# EAGLE design reamiga 1200 mouse USB v1 (EAGLE 7.5.0)
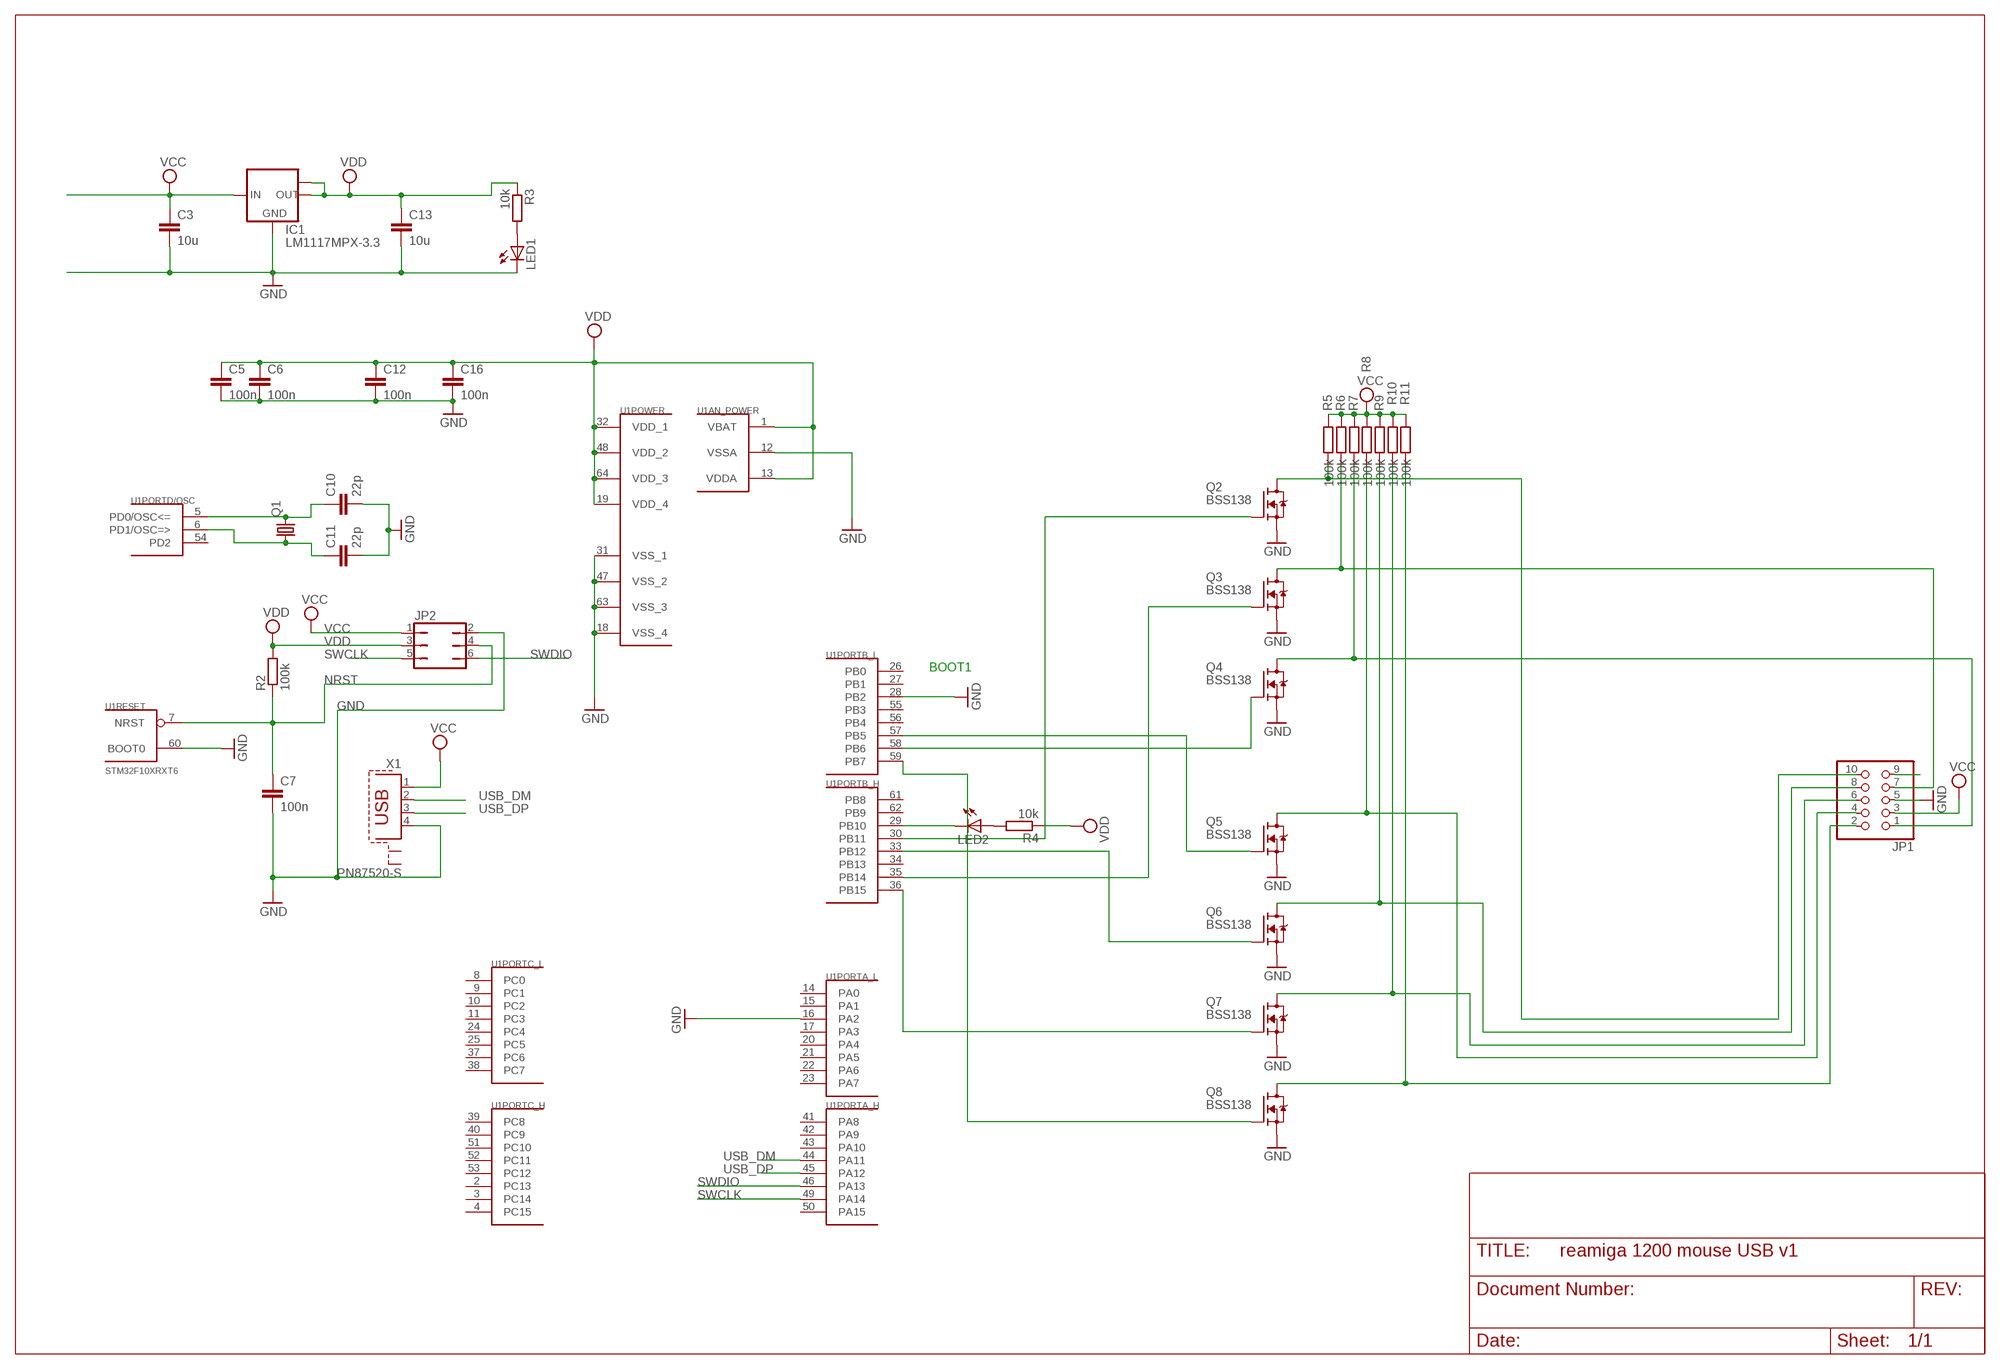
[diagram p0: schematic, sheet 1]

## Parts
C3  10u  C-EUC1206  [C1206]
C5  100n  C-EUC0603  [C0603]
C6  100n  C-EUC0603  [C0603]
C7  100n  C-EUC0603  [C0603]
C10  22p  C-EUC0603  [C0603]
C11  22p  C-EUC0603  [C0603]
C12  100n  C-EUC0603  [C0603]
C13  10u  C-EUC1206  [C1206]
C16  100n  C-EUC0603  [C0603]
IC1  LM1117MPX-3.3  [SOT223]
JP1  PINHD-2X5  [2X05]
JP2  JP3Q  [JP3Q]
LED1  LEDSML0805  [SML0805]
LED2  LEDSML0805  [SML0805]
Q1  CRYSTALHC49S  [HC49/S]
Q2  BSS138  [SOT23]
Q3  BSS138  [SOT23]
Q4  BSS138  [SOT23]
Q5  BSS138  [SOT23]
Q6  BSS138  [SOT23]
Q7  BSS138  [SOT23]
Q8  BSS138  [SOT23]
R2  100k  R-EU_R0603  [R0603]
R3  10k  R-EU_R0603  [R0603]
R4  10k  R-EU_R0603  [R0603]
R5  100k  R-EU_R0603  [R0603]
R6  100k  R-EU_R0603  [R0603]
R7  100k  R-EU_R0603  [R0603]
R8  100k  R-EU_R0603  [R0603]
R9  100k  R-EU_R0603  [R0603]
R10  100k  R-EU_R0603  [R0603]
R11  100k  R-EU_R0603  [R0603]
U1  STM32F10XRXT6  [TQFP64]
X1  PN87520-S  [PN87520-S]

## Nets
GND: C3.2 C5.2 C6.2 C7.2 C10.2 C11.2 C12.2 C13.2 C16.2 IC1.1(GND) JP1.5 JP2.2 LED1.C Q2.2(S) Q3.2(S) Q4.2(S) Q5.2(S) Q6.2(S) Q7.2(S) Q8.2(S) U1.12(AN_POWER:VSSA) U1.16(PORTA_L:PA2) U1.18(POWER:VSS_4) U1.28(PORTB_L:PB2) U1.31(POWER:VSS_1) U1.47(POWER:VSS_2) U1.60(RESET:BOOT0) U1.63(POWER:VSS_3) X1.4
N$1: C10.1 Q1.2 U1.5(PORTD/OSC:PD0/OSC<=)
N$2: C11.1 Q1.1 U1.6(PORTD/OSC:PD1/OSC=>)
N$3: Q3.1(G) U1.35(PORTB_H:PB14)
N$4: JP1.9
N$5: Q5.1(G) U1.57(PORTB_L:PB5)
N$6: Q4.1(G) U1.58(PORTB_L:PB6)
N$7: LED2.A R4.2
N$8: LED2.C U1.29(PORTB_H:PB10)
N$12: LED1.A R3.2
N$13: Q2.1(G) U1.30(PORTB_H:PB11)
N$17: Q6.1(G) U1.33(PORTB_H:PB12)
N$18: Q7.1(G) U1.36(PORTB_H:PB15)
N$19: Q8.1(G) U1.59(PORTB_L:PB7)
N$34: JP1.10 Q2.3(D) R5.2
N$35: JP1.7 Q3.3(D) R6.2
N$36: JP1.1 Q4.3(D) R7.2
N$37: JP1.4 Q5.3(D) R8.2
N$38: JP1.8 Q6.3(D) R9.2
N$39: JP1.6 Q7.3(D) R10.2
N$40: JP1.2 Q8.3(D) R11.2
NRST: C7.1 JP2.4 R2.1 U1.7(RESET:NRST)
SWCLK: JP2.5 U1.49(PORTA_H:PA14)
SWDIO: JP2.6 U1.46(PORTA_H:PA13)
USB_DM: U1.44(PORTA_H:PA11) X1.2
USB_DP: U1.45(PORTA_H:PA12) X1.3
VCC: C3.1 IC1.3(IN) JP1.3 JP2.1 R5.1 R6.1 R7.1 R8.1 R9.1 R10.1 R11.1 X1.1
VDD: C5.1 C6.1 C12.1 C13.1 C16.1 IC1.2(OUT) IC1.TAB(OUT1) JP2.3 R2.2 R3.1 R4.1 U1.1(AN_POWER:VBAT) U1.13(AN_POWER:VDDA) U1.19(POWER:VDD_4) U1.32(POWER:VDD_1) U1.48(POWER:VDD_2) U1.64(POWER:VDD_3)
Unconnected: U1.2(PORTC_H:PC13) U1.3(PORTC_H:PC14) U1.4(PORTC_H:PC15) U1.8(PORTC_L:PC0) U1.9(PORTC_L:PC1) U1.10(PORTC_L:PC2) U1.11(PORTC_L:PC3) U1.14(PORTA_L:PA0) U1.15(PORTA_L:PA1) U1.17(PORTA_L:PA3) U1.20(PORTA_L:PA4) U1.21(PORTA_L:PA5) U1.22(PORTA_L:PA6) U1.23(PORTA_L:PA7) U1.24(PORTC_L:PC4) U1.25(PORTC_L:PC5) U1.26(PORTB_L:PB0) U1.27(PORTB_L:PB1) U1.34(PORTB_H:PB13) U1.37(PORTC_L:PC6) U1.38(PORTC_L:PC7) U1.39(PORTC_H:PC8) U1.40(PORTC_H:PC9) U1.41(PORTA_H:PA8) U1.42(PORTA_H:PA9) U1.43(PORTA_H:PA10) U1.50(PORTA_H:PA15) U1.51(PORTC_H:PC10) U1.52(PORTC_H:PC11) U1.53(PORTC_H:PC12) U1.54(PORTD/OSC:PD2) U1.55(PORTB_L:PB3) U1.56(PORTB_L:PB4) U1.61(PORTB_H:PB8) U1.62(PORTB_H:PB9) X1.S1 X1.S2

## Notes on the sheet
- BOOT1

## Library data of the parts
C3 C5-C7 C10-C13 C16 = rcl:C-EU: CAPACITOR, European symbol; SPICEPREFIX: C
IC1 = lm1117:LM1117MPX-*
JP1 = pinhead:PINHD-2X5: PIN HEADER
JP2 = jumper:JP3Q: JUMPER
LED1 LED2 = led:LED: LED OSRAM: - CHIPLED LG R971, LG N971, LY N971, LG Q971, LY Q971, LO R971, LY R971 LH N974, LH R974 LS Q976, LO Q976, LY Q976 LO Q996 - Hyper CHIPLED LW Q18S LB Q993, LB Q99A, LB R99A - SideLED LS A670, LO A670, LY A670, LG A670, LP A670 LB A673, LV A673, LT A673, LW A673 LH A674 LY A675 LS A676, LA A676, LO A676, LY A676, LW A676 LS A679, LY A679, LG A679 - Hyper Micro SIDELED® LS Y876, LA Y876, LO Y876, LY Y876 LT Y87S - SmartLED LW L88C, LW L88S LB L89C, LB L89S, LG L890 LS L89K, LO L89K, LY L89K LS L896, LA L896, LO L896, LY L896 - TOPLED LS T670, LO T670, LY T670, LG T670, LP T670 LSG T670, LSP T670, LSY T670, LOP T670, LYG T670 LG T671, LOG T671, LSG T671 LB T673, LV T673, LT T673, LW T673 LH T674 LS T676, LA T676, LO T676, LY T676, LB T676, LH T676, LSB T676, LW T676 LB T67C, LV T67C, LT T67C, LS T67K, LO T67K, LY T67K, LW E67C LS E67B, LA E67B, LO E67B, LY E67B, LB E67C, LV E67C, LT E67C LW T67C LS T679, LY T679, LG T679 LS T770, LO T770, LY T770, LG T770, LP T770 LB T773, LV T773, LT T773, LW T773 LH T774 LS E675, LA E675, LY E675, LS T675 LS T776, LA T776, LO T776, LY T776, LB T776 LHGB T686 LT T68C, LB T68C - Hyper Mini TOPLED® LB M676 - Mini TOPLED Santana® LG M470 LS M47K, LO M47K, LY M47K Source: http://www.osram.convergy.de LUXEON: - LUMILED® LXK2-PW12-R00, LXK2-PW12-S00, LXK2-PW14-U00, LXK2-PW14-V00 LXK2-PM12-R00, LXK2-PM12-S00, LXK2-PM14-U00 LXK2-PE12-Q00, LXK2-PE12-R00, LXK2-PE12-S00, LXK2-PE14-T00, LXK2-PE14-U00 LXK2-PB12-K00, LXK2-PB12-L00, LXK2-PB12-M00, LXK2-PB14-N00, LXK2-PB14-P00, LXK2-PB14-Q00 LXK2-PR12-L00, LXK2-PR12-M00, LXK2-PR14-Q00, LXK2-PR14-R00 LXK2-PD12-Q00, LXK2-PD12-R00, LXK2-PD12-S00 LXK2-PH12-R00, LXK2-PH12-S00 LXK2-PL12-P00, LXK2-PL12-Q00, LXK2-PL12-R00 Source: www.luxeon.com KINGBRIGHT: KA-3528ASYC Source: www.kingbright.com
Q1 = crystal:CRYSTAL: CRYSTAL; OC_FARNELL: 1667008; OC_NEWARK: unknown
Q2-Q8 = bss138_10:BSS138: BSS138 N-Channel Logic Level Enhancement Mode Field Effect Transistor Source: http://www.fairchildsemi.com/datasheets/BS/BSS138.pdf; MF: Fairchild; MPN: BSS138; OC_FARNELL: 9845330; OC_NEWARK: 67R2009
R2-R11 = rcl:R-EU_: RESISTOR, European symbol; SPICEPREFIX: R
U1 = stm32:STM32F10XRXT6: STM32F101/103 64pin LQFP
X1 = con-berg:PN87520-S; OC_FARNELL: unknown; OC_NEWARK: unknown

## Board
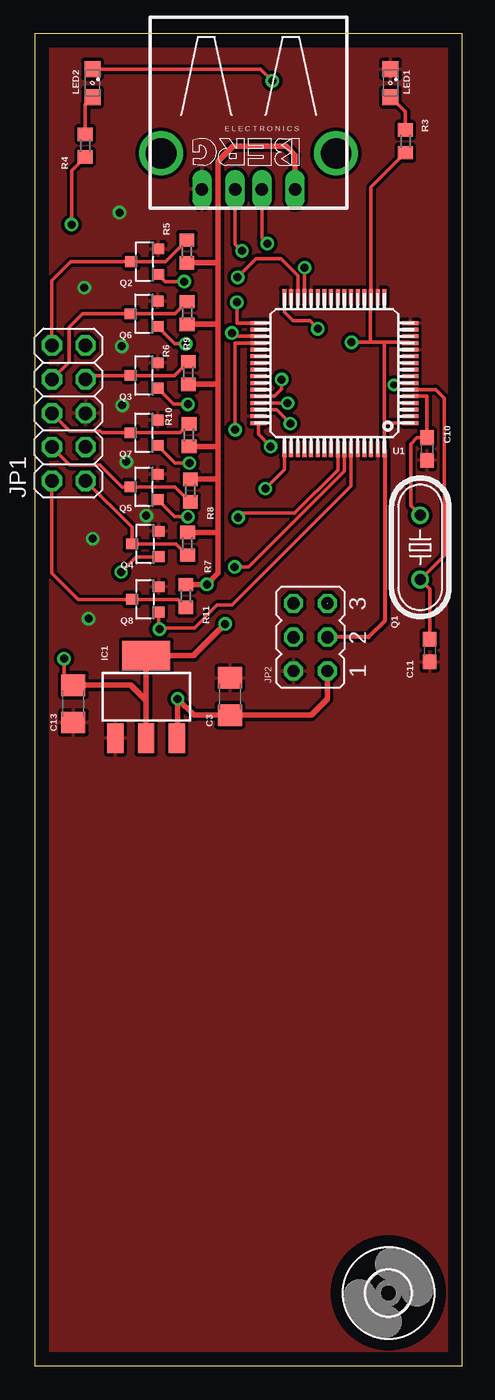
[diagram p1: board, top side]
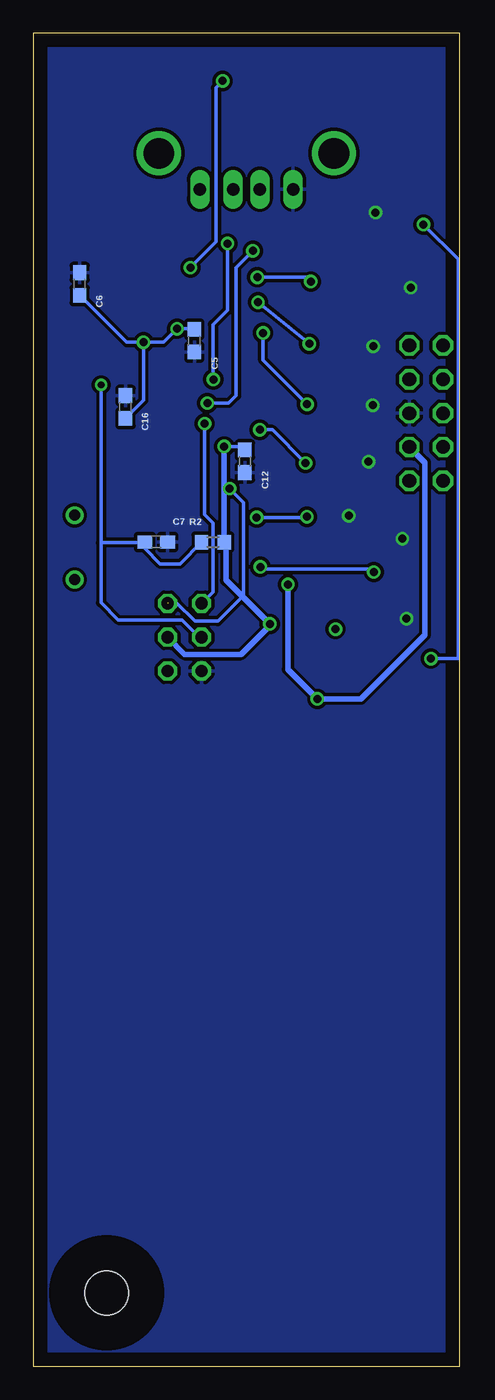
[diagram p2: board, bottom side, seen from below]

Size 32 x 100 mm. Coordinates in mm from the lower left corner, seen from the top.
Outline: 0,0 0,100 32,100 32,0 0,0
Copper layers (1*16): Top 0.035mm / dielectric 1.5mm / Bottom 0.035mm
Design rules "default": minimum track width 6mil, minimum drill 0.35mm, track to track 6mil, track to pad 6mil, pad to pad 6mil, via to via 6mil, smd to smd 6mil, copper to edge 40mil, drill to drill 6mil, minimum pad ring 10mil, minimum via ring 8mil, stop-mask expansion 4mil, vias tented up to drill 0mil, thermal gap 10mil

### Footprints (pad centres in the part's own frame; a part is rotated, then mirrored left to right if it is on the bottom)
C1206 = smd 1.6 x 1.8: 1 -1.4,0; 2 1.4,0
C0603 = smd 1.1 x 1: 1 -0.85,0; 2 0.85,0
SOT223 = smd 1.219 x 2.235: 1 -2.311,-3.099; 2 0,-3.099; 3 2.311,-3.099 | smd 3.6 x 2.2: TAB 0,3.099
2X05 = drill 1.016 octagon: 1 -5.08,-1.27; 2 -5.08,1.27; 3 -2.54,-1.27; 4 -2.54,1.27; 5 0,-1.27; 6 0,1.27; 7 2.54,-1.27; 8 2.54,1.27; 9 5.08,-1.27; 10 5.08,1.27
JP3Q = drill 0.914 octagon: 1 -2.54,-1.27; 2 -2.54,1.27; 3 0,-1.27; 4 0,1.27; 5 2.54,-1.27; 6 2.54,1.27
SML0805 = smd 1.2 x 1.2: A 1.05,0; C -1.05,0
HC49/S = drill 0.813: 1 -2.413,0; 2 2.413,0
SOT23 = smd 0.8 x 0.9: 1 -0.95,-1; 2 0.95,-1; 3 0,1
R0603 = smd 1 x 1.1: 1 -0.85,0; 2 0.85,0
TQFP64 = smd 1.2 x 0.3: 1 -5.7,3.75; 2 -5.7,3.25; 3 -5.7,2.75; 4 -5.7,2.25; 5 -5.7,1.75; 6 -5.7,1.25; 7 -5.7,0.75; 8 -5.7,0.25; 9 -5.7,-0.25; 10 -5.7,-0.75; 11 -5.7,-1.25; 12 -5.7,-1.75; 13 -5.7,-2.25; 14 -5.7,-2.75; 15 -5.7,-3.25; 16 -5.7,-3.75; 33 5.7,-3.75; 34 5.7,-3.25; 35 5.7,-2.75; 36 5.7,-2.25; 37 5.7,-1.75; 38 5.7,-1.25; 39 5.7,-0.75; 40 5.7,-0.25; 41 5.7,0.25; 42 5.7,0.75; 43 5.7,1.25; 44 5.7,1.75; 45 5.7,2.25; 46 5.7,2.75; 47 5.7,3.25; 48 5.7,3.75 | smd 0.3 x 1.2: 17 -3.75,-5.7; 18 -3.25,-5.7; 19 -2.75,-5.7; 20 -2.25,-5.7; 21 -1.75,-5.7; 22 -1.25,-5.7; 23 -0.75,-5.7; 24 -0.25,-5.7; 25 0.25,-5.7; 26 0.75,-5.7; 27 1.25,-5.7; 28 1.75,-5.7; 29 2.25,-5.7; 30 2.75,-5.7; 31 3.25,-5.7; 32 3.75,-5.7; 49 3.75,5.7; 50 3.25,5.7; 51 2.75,5.7; 52 2.25,5.7; 53 1.75,5.7; 54 1.25,5.7; 55 0.75,5.7; 56 0.25,5.7; 57 -0.25,5.7; 58 -0.75,5.7; 59 -1.25,5.7; 60 -1.75,5.7; 61 -2.25,5.7; 62 -2.75,5.7; 63 -3.25,5.7; 64 -3.75,5.7
3,3 = hole 3.3: 0,0
PN87520-S = drill 0.95 long: 1 -3.5,2.71; 2 -1,2.71; 3 1,2.71; 4 3.5,2.71 | drill 2.3 pad 2.9: S1 -6.57,0; S2 6.57,0

### Placement (x,y rotation side)
C3  14.59,50.24 90 top
C5  19.91,76.94 270 bottom
C6  28.51,81.19 90 bottom
C7  22.77,61.84 0 bottom
C10  29.4,68.81 270 top
C11  29.6,53.7 270 top
C12  16.12,67.89 270 bottom
C13  2.85,49.7 270 top
C16  25.08,71.97 90 bottom
IC1  8.31,50.21 0 top
JP1  2.5,71.5 90 top
JP2  20.65,54.69 90 top
LED1  26.66,96.27 270 top
LED2  4.29,96.27 270 top
Q1  28.89,61.43 90 top
Q2  8.2,82.87 90 top
Q3  8.16,74.33 90 top
Q4  8.25,61.69 90 top
Q5  8.16,65.97 90 top
Q6  8.16,78.96 90 top
Q7  8.16,70.04 90 top
Q8  8.25,57.53 90 top
R2  18.51,61.82 0 bottom
R3  27.78,91.89 90 top
R4  3.74,91.57 90 top
R5  11.37,83.63 90 top
R6  11.48,74.51 90 top
R7  11.42,61.7 270 top
R8  11.62,65.7 270 top
R9  11.39,79.02 90 top
R10  11.53,69.86 90 top
R11  11.3,57.79 270 top
U1  22.45,74.52 180 top
U$1  [3,3]  26.5,5.5 0 top
X1  16,91 180 top

### Tracks (layer width: path | path; a pad name or v marks a point on that pad's centre or on a via)
GND  (via drill 0.6)
  other vias: 6.31,86.55 3.67,80.92 6.48,76.52 6.52,72.09 6.83,67.86 8.32,63.81 4.3,62.09 3.99,56.08
  pour Bottom (isolate 0.254): 0,0 0,100 32,100 32,0
  pour Top (isolate 0.254): 0,-0.14 0,100 32,100 32,-0.14
N$1
  Top 0.254: U1.5 29.4,72.77 C10.1 28.65,69.66 28.18,69.19 28.18,64.56 Q1.2
N$2
  Top 0.254: U1.6 30.06,73.27 30.7,72.63 30.7,60.83 Q1.1 29.6,58.31 C11.1
N$3  (via drill 0.6)
  Top 0.254: v11.45,72.17 10.38,72.17 Q3.1 | U1.35 15.04,77.27 v14.75,77.52
  Bottom 0.254: v11.45,72.17 14.75,75.47 v14.75,77.52
N$5  (via drill 0.6)
  Top 0.254: U1.57 22.7,67.25 19.45,64 15.56,64 v15.23,63.67 | v11.45,63.73 10.45,63.73 Q5.1
  Bottom 0.254: v15.23,63.67 11.51,63.67 v11.45,63.73
N$6  (via drill 0.6)
  Top 0.254: U1.58 23.2,67.15 16.01,59.97 v14.96,59.97 | Q4.1 9.25,60.71 7.56,60.71 v6.43,59.58
  Bottom 0.254: v14.96,59.97 14.78,59.79 6.65,59.79 v6.43,59.58
N$7
  Top 0.254: LED2.A 3.74,94.68 R4.2
N$8  (via drill 0.6)
  Top 0.254: LED2.C 16.89,97.32 v17.78,96.43 | v20.2,82.42 v20.2,82.41 U1.29
  Bottom 0.254: v17.78,96.43 18.29,95.92 18.29,84.35 20.2,82.44 v20.2,82.42
N$12
  Top 0.254: LED1.A 27.78,94.11 R3.2
N$13  (via drill 0.6)
  Top 0.254: U1.30 19.7,81.81 18.43,83.08 16.55,83.08 v15.18,81.7 | v11.17,81.37 9.75,81.37 Q2.1
  Bottom 0.254: v15.18,81.7 11.5,81.7 v11.17,81.37
N$17  (via drill 0.6)
  Top 0.254: v11.29,76.7 10.47,76.7 Q6.1 | U1.33 15.13,78.27 v15.13,79.83
  Bottom 0.254: v11.29,76.7 v15.13,79.83
N$18  (via drill 0.6)
  Top 0.254: v11.56,67.76 10.49,67.76 Q7.1 | U1.36 14.99,76.77 v14.99,70.25
  Bottom 0.254: v11.56,67.76 14.06,70.25 v14.99,70.25
N$19  (via drill 0.6)
  Top 0.254: v9.31,55.3 9.25,55.3 | U1.59 23.7,66.04 14.74,57.09 13.64,57.09 11.93,55.39 9.39,55.39 v9.31,55.3 | Q8.1 9.25,55.36 v9.31,55.3
N$34
  Top 0.254: JP1.10 1.23,81.45 2.64,82.87 7.19,82.87 Q2.3 9.76,82.87 R5.2
N$35
  Top 0.254: JP1.7 4.06,74.33 Q3.3 10.45,74.33 R6.2
N$36
  Top 0.254: JP1.1 7.25,62.94 Q4.3 10.58,61.69 R7.2
N$37
  Top 0.254: JP1.4 2.56,67.62 4.87,67.62 6.52,65.97 Q5.3 10.5,65.97 R8.2
N$38
  Top 0.254: JP1.8 2.53,75.34 2.53,77.94 3.54,78.96 Q6.3 10.48,78.96 R9.2
N$39
  Top 0.254: JP1.6 2.56,70.17 4.87,70.17 5,70.04 Q7.3 10.86,70.04 R10.2
N$40
  Top 0.254: JP1.2 1.23,59.51 3.21,57.53 Q8.3 10.7,57.53 R11.2
NRST  (via drill 0.5 pad 0.25)
  Top 0.254: v26.91,73.63 27.38,73.77 U1.7
  Bottom 0.254: v26.91,73.63 26.91,61.79 | 26.91,61.79 26.91,57.28 25.62,55.99 20.84,55.99 19.54,54.69 JP2.4 | 26.91,61.79 23.67,61.79 C7.1 23.62,61.36 22.47,60.2 20.99,60.2 R2.1
SWCLK  (via drill 0.6)  (1 unrouted)
  Top 0.254: U1.49 18.7,67.28 v17.26,65.85
  Bottom 0.254: v17.26,65.85 16.22,64.8 16.22,57.82 18.14,55.9 19.86,55.9 21.24,57.27 21.88,57.27
SWDIO  (via drill 0.6)
  Top 0.254: U1.46 18.09,71.77 v19.14,70.72
  Bottom 0.254: v19.14,70.72 19.14,63.89 18.52,63.27 18.52,58.09 JP2.6
USB_DM  (via drill 0.6)
  Top 0.254: X1.2 17,84.65 v17.42,84.23 | v18.48,74.03 18.48,73.31 17.94,72.77 U1.44
  Bottom 0.254: v17.42,84.23 17.42,79.25 18.52,78.15 18.52,74.07 v18.48,74.03
USB_DP  (via drill 0.6)
  Top 0.254: X1.3 15,84.19 v15.51,83.68 | v18.94,72.26 18.92,72.27 U1.45
  Bottom 0.254: v15.51,83.68 16.77,82.42 16.77,72.81 17.33,72.26 v18.94,72.26
VCC  (via drill 0.6)
  Top 0.406: IC1.3 10.67,47.16 v10.67,50.07 11.9,48.84 C3.1 20.72,48.84 21.92,50.04 JP2.1 | X1.1 19.5,90.86 18.84,91.52 14.85,91.52 13.72,90.4 13.72,82.76 | 13.72,82.76 13.72,78.08 | 13.72,78.08 13.72,73.8 | 13.72,73.8 13.72,68.9 | 13.72,68.9 13.72,66.43 | 13.72,66.43 13.72,62.55 | 13.72,62.55 13.72,59.49 v12.88,58.65 v12.87,58.64 R11.1 | R7.1 13.72,62.55 | R8.1 13.61,66.55 13.72,66.43 | R10.1 13.62,69.01 13.72,68.9 | R6.1 13.59,73.66 13.72,73.8 | R9.1 13.63,78.17 13.72,78.08 | R5.1 13.71,82.78 13.72,82.76
  Bottom 0.406: JP1.3 2.61,67.8 2.61,54.86 7.4,50.07 v10.67,50.07 12.88,52.27 v12.88,58.65
VDD  (via drill 0.6)
  Top 0.254: 26.2,76.82 25.16,76.82 | 25.16,76.82 v23.73,76.82 | U1.13 28.1,76.82 26.2,76.82 | 25.16,76.82 25.16,80.19 U1.19 25.2,88.46 R3.1 | R4.1 2.7,89.68 v2.7,85.65 | v2.15,53.09 2.15,51.1 C13.1 | U1.1 26.2,70.77 | 26.2,70.77 26.2,76.82 | 26.2,70.77 U1.64 26.22,68.8 | U1.48 16.75,69.92 v17.66,69 | U1.32 18.7,79.07 19.32,78.45 20.59,78.45 v21.2,77.84
  Top 0.305: 26.22,68.8 26.22,55.9 25.01,54.69 JP2.3
  Top 0.406: C13.1 7.13,51.1 8.3,49.93 8.3,49.8 | 8.3,49.8 8.3,47.13 IC1.2 | 8.3,49.8 8.31,49.82 IC1.TAB 11.87,53.31 v14.25,55.68
  Bottom 0.254: C16.1 23.73,72.47 v23.73,76.82 | C6.1 24.99,76.82 v23.73,76.82 | v2.7,85.65 0.1,83.04 0.1,53.09 v2.15,53.09 | R2.2 17.54,61.7 | v17.66,69 16.38,69 C12.1 | C5.1 19.95,77.84 v21.2,77.84 22.22,76.82 v23.73,76.82
  Bottom 0.406: JP2.3 20.64,53.41 16.42,53.41 14.25,55.58 v14.25,55.68 17.54,58.98 17.54,61.7 | v17.66,69 R2.2